# Altium project Mynd_Main.PrjPcb (part 1 of 3)
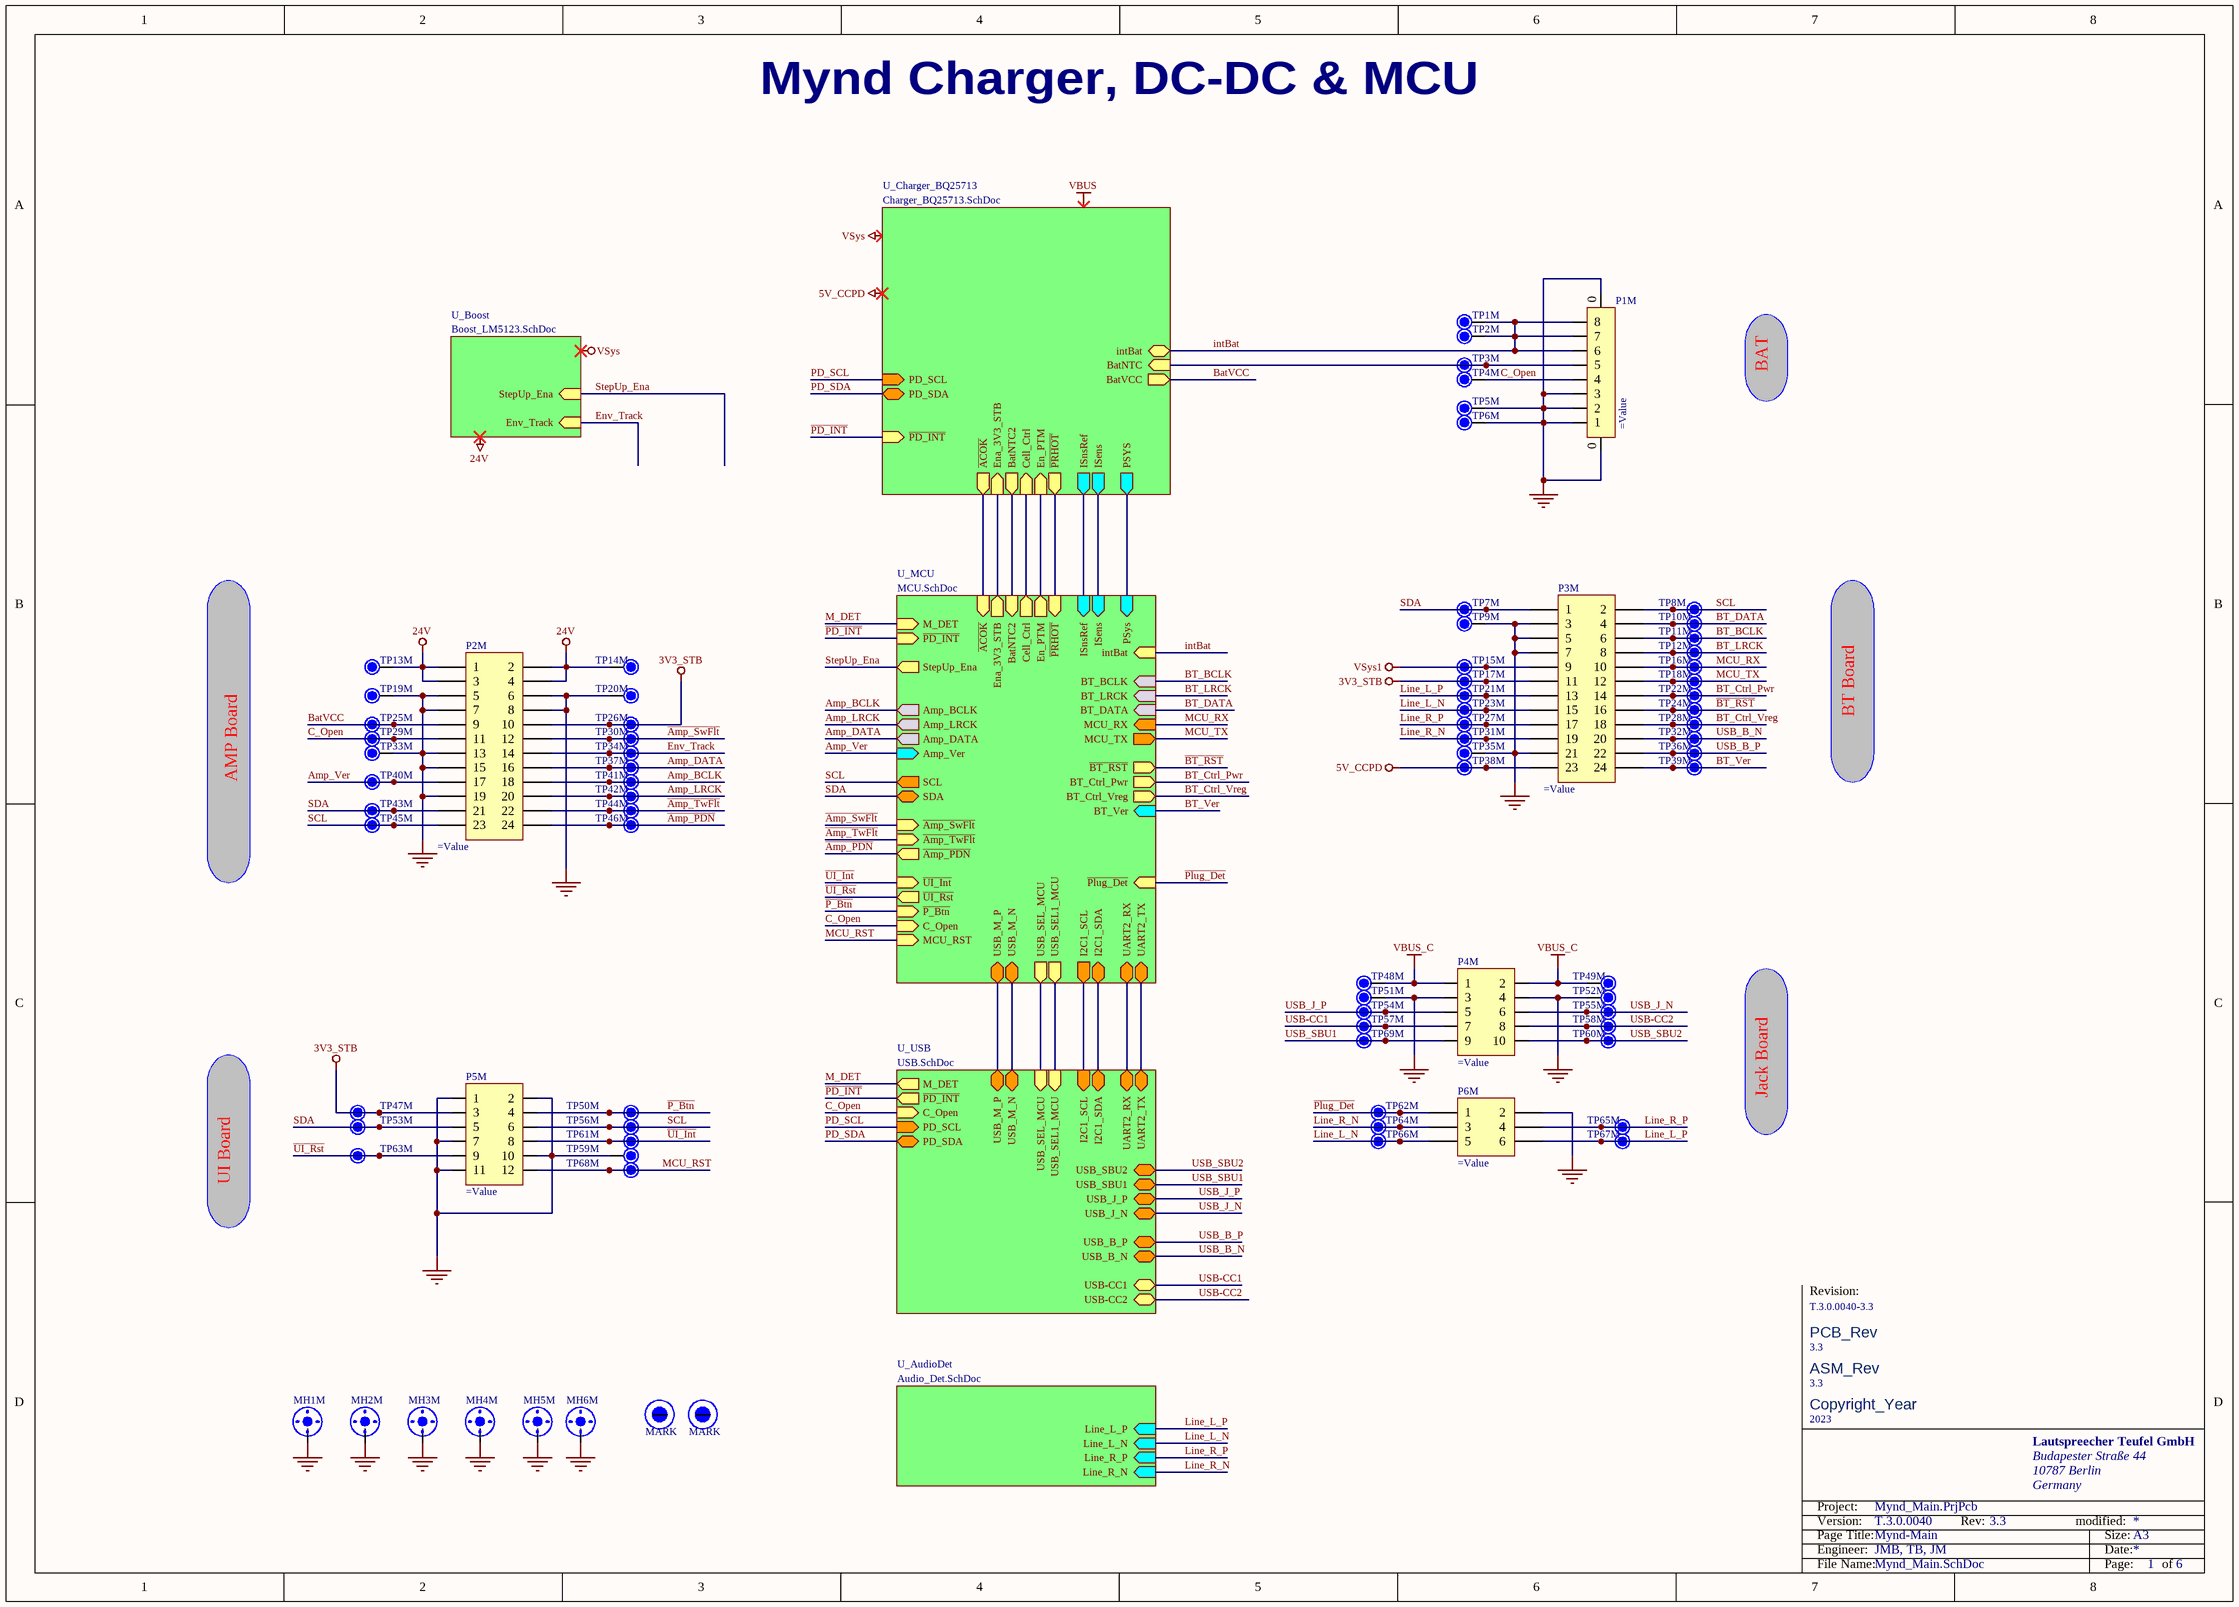
[diagram p0: Mynd_Main.SchDoc]
Address1: Budapester Straße 44; Address2: 10787 Berlin; Address3: Germany; ASM_Rev: 3.3; CompanyName: Lautsprecher Teufel GmbH; Copyright_Year: 2023; DOC_NO_SCH_DWG: Mynd_Main; Engineer: JMB, TB, JM; ISSUE_DATE: 20230810; Model_NO: PS2307; PCB_REV: 3.3; QBOM-AIEQ-NUMBER: AIEPS2307-Q0D1; QBOM-APE-NUMBER: APEPS2307-00D1; QBOM-APEQ-NUMBER: APEPS2307-Q0D1; QBOM-L-NUMBER: LRDPS2307-H001; REV_DATE: 20231025; Revision: 3.3; SCH_Approver: JianHua.Zhong; SCH_Checker: Aileen.zheng; SCH_Designer: GuoHui.Lin; SCH_REV: 3.3; SCH_Title: Mynd; Version: T.3.0.0040
6 sheets, 561 parts. Net scope: hierarchical (ports join the sheet entries above them; power ports are global).
Board file: Mynd_Main.PcbDoc
Sheets:
  Mynd_Main.SchDoc
    U_USB = USB.SchDoc
    U_MCU = MCU.SchDoc
    U_AudioDet = Audio_Det.SchDoc
    U_Boost = Boost_LM5123.SchDoc
    U_Charger_BQ25713 = Charger_BQ25713.SchDoc

## Sheet Mynd_Main.SchDoc: Mynd-Main
size A3; PageSetup: Record=PageOptions|CenterHorizontal=True|CenterVertical=True|PrintScale=0.70|XCorrection=1.00|YCorrection=1.00|PrintKind=0|BorderSize=5000000|LeftOffset=0|BottomOffset=0|Orientation=2|PaperLength=1000|PaperWidth=1000|Scale=100|PaperSource=7|PrintQuality=-4|MediaType=1|DitherType=10|PaperKind=A4|PrintScaleMode=1; ApprovedBy: Jianhua.Zhong; CheckedBy: Aileen.zheng; DrawnBy: GuoHui.Lin; Revision: 3.3; SheetNumber: 1; SheetTotal: 6; Model NO.: PS2307; ISSUE DATE: 20230810; REV DATE: 20240117; PCB_Rev: 3.3; ASM_Rev: 3.3

### Parts
MH1M  SCREW_HOLE_D30  [SCREW_D30]  (value not drawn)  (no BOM)
MH2M  SCREW_HOLE_D30  [SCREW_D30]  (value not drawn)  (no BOM)
MH3M  SCREW_HOLE_D30  [SCREW_D30]  (value not drawn)  (no BOM)
MH4M  SCREW_HOLE_D30  [SCREW_D30]  (value not drawn)  (no BOM)
MH5M  SCREW_HOLE_D30  [SCREW_D30]  (value not drawn)  (no BOM)
MH6M  SCREW_HOLE_D30  [SCREW_D30]  (value not drawn)  (no BOM)
MK1M  MARK  [MARK]  (no BOM)
MK2M  MARK  [MARK]  (no BOM)
P1M  (no value)  [CON_250_SMD_H_8P]
P2M  (no value)  [Female_SMD_Bottom_2X12_254]
P3M  (no value)  [Female_SMD_Bottom_2X12_254]
P4M  (no value)  [WB200AL_2x5P]
P5M  (no value)  [WB200AL_2x6P]
P6M  (no value)  [WB200AL_2x3P]
Teufel_ASM_Label1M  3.3  [Teufel_ASM_Rev]  (no BOM)
Teufel_Copyright1M  2023  [TEUFEL_COPYRIGHT]  (no BOM)
Teufel_PCB_Label1M  3.3  [Teufel_PCB_Rev]  (no BOM)
Teufel_PCB_Logo1M  T.3.0.0040-3.3  [Teufel_NoLogo]  (no BOM)
TP1M  TP12  [TP120]  (value not drawn)  (no BOM)
TP2M  TP12  [TP120]  (value not drawn)  (no BOM)
TP3M  TP12  [TP120]  (value not drawn)  (no BOM)
TP4M  TP12  [TP120]  (value not drawn)  (no BOM)
TP5M  TP12  [TP120]  (value not drawn)  (no BOM)
TP6M  TP12  [TP120]  (value not drawn)  (no BOM)
TP7M  TP12  [TP120]  (value not drawn)  (no BOM)
TP8M  TP12  [TP120]  (value not drawn)  (no BOM)
TP9M  TP12  [TP120]  (value not drawn)  (no BOM)
TP10M  TP12  [TP120]  (value not drawn)  (no BOM)
TP11M  TP12  [TP120]  (value not drawn)  (no BOM)
TP12M  TP12  [TP120]  (value not drawn)  (no BOM)
TP13M  TP12  [TP120]  (value not drawn)  (no BOM)
TP14M  TP12  [TP120]  (value not drawn)  (no BOM)
TP15M  TP12  [TP120]  (value not drawn)  (no BOM)
TP16M  TP12  [TP120]  (value not drawn)  (no BOM)
TP17M  TP12  [TP120]  (value not drawn)  (no BOM)
TP18M  TP12  [TP120]  (value not drawn)  (no BOM)
TP19M  TP12  [TP120]  (value not drawn)  (no BOM)
TP20M  TP12  [TP120]  (value not drawn)  (no BOM)
TP21M  TP12  [TP120]  (value not drawn)  (no BOM)
TP22M  TP12  [TP120]  (value not drawn)  (no BOM)
TP23M  TP12  [TP120]  (value not drawn)  (no BOM)
TP24M  TP12  [TP120]  (value not drawn)  (no BOM)
TP25M  TP12  [TP120]  (value not drawn)  (no BOM)
TP26M  TP12  [TP120]  (value not drawn)  (no BOM)
TP27M  TP12  [TP120]  (value not drawn)  (no BOM)
TP28M  TP12  [TP120]  (value not drawn)  (no BOM)
TP29M  TP12  [TP120]  (value not drawn)  (no BOM)
TP30M  TP12  [TP120]  (value not drawn)  (no BOM)
TP31M  TP12  [TP120]  (value not drawn)  (no BOM)
TP32M  TP12  [TP120]  (value not drawn)  (no BOM)
TP33M  TP12  [TP120]  (value not drawn)  (no BOM)
TP34M  TP12  [TP120]  (value not drawn)  (no BOM)
TP35M  TP12  [TP120]  (value not drawn)  (no BOM)
TP36M  TP12  [TP120]  (value not drawn)  (no BOM)
TP37M  TP12  [TP120]  (value not drawn)  (no BOM)
TP38M  TP12  [TP120]  (value not drawn)  (no BOM)
TP39M  TP12  [TP120]  (value not drawn)  (no BOM)
TP40M  TP12  [TP120]  (value not drawn)  (no BOM)
TP41M  TP12  [TP120]  (value not drawn)  (no BOM)
TP42M  TP12  [TP120]  (value not drawn)  (no BOM)
TP43M  TP12  [TP120]  (value not drawn)  (no BOM)
TP44M  TP12  [TP120]  (value not drawn)  (no BOM)
TP45M  TP12  [TP120]  (value not drawn)  (no BOM)
TP46M  TP12  [TP120]  (value not drawn)  (no BOM)
TP47M  TP12  [TP120]  (value not drawn)  (no BOM)
TP48M  TP12  [TP120]  (value not drawn)  (no BOM)
TP49M  TP12  [TP120]  (value not drawn)  (no BOM)
TP50M  TP12  [TP120]  (value not drawn)  (no BOM)
TP51M  TP12  [TP120]  (value not drawn)  (no BOM)
TP52M  TP12  [TP120]  (value not drawn)  (no BOM)
TP53M  TP12  [TP120]  (value not drawn)  (no BOM)
TP54M  TP12  [TP120]  (value not drawn)  (no BOM)
TP55M  TP12  [TP120]  (value not drawn)  (no BOM)
TP56M  TP12  [TP120]  (value not drawn)  (no BOM)
TP57M  TP12  [TP120]  (value not drawn)  (no BOM)
TP58M  TP12  [TP120]  (value not drawn)  (no BOM)
TP59M  TP12  [TP120]  (value not drawn)  (no BOM)
TP60M  TP12  [TP120]  (value not drawn)  (no BOM)
TP61M  TP12  [TP120]  (value not drawn)  (no BOM)
TP62M  TP12  [TP120]  (value not drawn)  (no BOM)
TP63M  TP12  [TP120]  (value not drawn)  (no BOM)
TP64M  TP12  [TP120]  (value not drawn)  (no BOM)
TP65M  TP12  [TP120]  (value not drawn)  (no BOM)
TP66M  TP12  [TP120]  (value not drawn)  (no BOM)
TP67M  TP12  [TP120]  (value not drawn)  (no BOM)
TP68M  TP12  [TP120]  (value not drawn)  (no BOM)
TP69M  TP12  [TP120]  (value not drawn)  (no BOM)

### Sub-sheets
U_AudioDet = Audio_Det.SchDoc: Line_L_P (in), Line_L_N (in), Line_R_P (in), Line_R_N (in)
U_Boost = Boost_LM5123.SchDoc: Env_Track (in), StepUp_Ena (in)
U_Charger_BQ25713 = Charger_BQ25713.SchDoc: intBat (bidir), ISens (out), ISnsRef (out), Ena_3V3_STB (in), En_PTM (in), Cell_Ctrl (in), ~{PD_INT} (in), BatNTC (in), BatNTC2 (out), PD_SCL (in), PD_SDA (bidir), ~{ACOK} (out), ~{PRHOT} (out), PSYS (out), BatVCC (out)
U_MCU = MCU.SchDoc: ~{ACOK} (in), En_PTM (out), ~{PRHOT} (in), ISnsRef (in), ISens (in), StepUp_Ena (out), ~{Amp_PDN} (out), ~{Amp_TwFlt} (in), Amp_DATA (out), Amp_LRCK (out), Amp_BCLK (out), MCU_RX (in), MCU_TX (out), ~{BT_RST} (out), BT_Ctrl_Pwr (out), BT_Ctrl_Vreg (out), ~{Plug_Det} (in), ~{UI_Int} (in), ~{UI_Rst} (out), ~{P_Btn} (in), ~{PD_INT} (in), SCL (out), SDA (bidir), Ena_3V3_STB (out), I2C1_SCL (out), I2C1_SDA (bidir), USB_M_P (bidir), USB_SEL_MCU (out), USB_M_N (bidir), C_Open (in), Cell_Ctrl (out), ~{Amp_SwFlt} (in), BT_DATA (in), BT_LRCK (in), BT_BCLK (in), BatNTC2 (in), BT_Ver (in), Amp_Ver (in), M_DET (in), PSys (in), MCU_RST (in), USB_SEL1_MCU (out), UART2_RX (bidir), UART2_TX (bidir), intBat (in)
U_USB = USB.SchDoc: I2C1_SCL (in), ~{PD_INT} (out), I2C1_SDA (bidir), USB-CC1 (bidir), USB-CC2 (bidir), USB_J_P (bidir), USB_M_N (bidir), USB_B_N (bidir), USB_J_N (bidir), USB_M_P (bidir), USB_B_P (bidir), USB_SEL_MCU (in), PD_SCL (in), PD_SDA (bidir), M_DET (out), C_Open (in), USB_SEL1_MCU (in), USB_SBU1 (bidir), USB_SBU2 (bidir), UART2_RX (bidir), UART2_TX (bidir)

### Nets
3V3_STB: P2M.10 P3M.11 P5M.3 TP17M.1 TP26M.1 TP47M.1
5V_CCPD: P3M.23 TP38M.1
24V: P2M.1 P2M.2 P2M.3 P2M.4 TP13M.1 TP14M.1
GND: MH1M.1 MH2M.1 MH3M.1 MH4M.1 MH5M.1 MH6M.1 P1M.0 P1M.1 P1M.2 P1M.3 P2M.5 P2M.6 P2M.7 P2M.8 P2M.13 P2M.15 P2M.19 P3M.3 P3M.5 P3M.7 P3M.21 P4M.3 P4M.4 P5M.1 P5M.2 P5M.7 P5M.10 P5M.11 P6M.2 TP5M.1 TP6M.1 TP9M.1 TP19M.1 TP20M.1 TP33M.1 TP35M.1 TP51M.1 TP52M.1 TP59M.1
VBUS_C: P4M.1 P4M.2 TP48M.1 TP49M.1
VSys1: P3M.9 TP15M.1
~{ACOK}: sheet U_MCU/~{ACOK}, sheet U_Charger_BQ25713/~{ACOK}
~{BT_RST}: P3M.16 TP24M.1 ; sheet U_MCU/~{BT_RST}
~{P_Btn}: P5M.4 TP50M.1 ; sheet U_MCU/~{P_Btn}
~{PD_INT}: sheet U_USB/~{PD_INT}, sheet U_MCU/~{PD_INT}, sheet U_Charger_BQ25713/~{PD_INT}
~{Plug_Det}: P6M.1 TP62M.1 ; sheet U_MCU/~{Plug_Det}
~{PRHOT}: sheet U_MCU/~{PRHOT}, sheet U_Charger_BQ25713/~{PRHOT}
~{UI_Int}: P5M.8 TP61M.1 ; sheet U_MCU/~{UI_Int}
~{UI_Rst}: P5M.9 TP63M.1 ; sheet U_MCU/~{UI_Rst}
~{Amp_PDN}: P2M.24 TP46M.1 ; sheet U_MCU/~{Amp_PDN}
~{Amp_SwFlt}: P2M.12 TP30M.1 ; sheet U_MCU/~{Amp_SwFlt}
~{Amp_TwFlt}: P2M.22 TP44M.1 ; sheet U_MCU/~{Amp_TwFlt}
Amp_BCLK: P2M.18 TP41M.1 ; sheet U_MCU/Amp_BCLK
Amp_DATA: P2M.16 TP37M.1 ; sheet U_MCU/Amp_DATA
Amp_LRCK: P2M.20 TP42M.1 ; sheet U_MCU/Amp_LRCK
Amp_Ver: P2M.17 TP40M.1 ; sheet U_MCU/Amp_Ver
BatVCC: P2M.9 TP25M.1 ; sheet U_Charger_BQ25713/BatVCC
BT_BCLK: P3M.6 TP11M.1 ; sheet U_MCU/BT_BCLK
BT_Ctrl_Pwr: P3M.14 TP22M.1 ; sheet U_MCU/BT_Ctrl_Pwr
BT_Ctrl_Vreg: P3M.18 TP28M.1 ; sheet U_MCU/BT_Ctrl_Vreg
BT_DATA: P3M.4 TP10M.1 ; sheet U_MCU/BT_DATA
BT_LRCK: P3M.8 TP12M.1 ; sheet U_MCU/BT_LRCK
BT_Ver: P3M.24 TP39M.1 ; sheet U_MCU/BT_Ver
C_Open: P1M.4 P2M.11 TP4M.1 TP29M.1 ; sheet U_USB/C_Open, sheet U_MCU/C_Open
Ena_3V3_STB: sheet U_MCU/Ena_3V3_STB, sheet U_Charger_BQ25713/Ena_3V3_STB
Env_Track: P2M.14 TP34M.1 ; sheet U_Boost/Env_Track
I2C1_SCL: sheet U_USB/I2C1_SCL, sheet U_MCU/I2C1_SCL
I2C1_SDA: sheet U_USB/I2C1_SDA, sheet U_MCU/I2C1_SDA
intBat: P1M.6 P1M.7 P1M.8 TP1M.1 TP2M.1 ; sheet U_MCU/intBat, sheet U_Charger_BQ25713/intBat
Line_L_N: P3M.15 P6M.5 TP23M.1 TP66M.1 ; sheet U_AudioDet/Line_L_N
Line_L_P: P3M.13 P6M.6 TP21M.1 TP67M.1 ; sheet U_AudioDet/Line_L_P
Line_R_N: P3M.19 P6M.3 TP31M.1 TP64M.1 ; sheet U_AudioDet/Line_R_N
Line_R_P: P3M.17 P6M.4 TP27M.1 TP65M.1 ; sheet U_AudioDet/Line_R_P
M_DET: sheet U_USB/M_DET, sheet U_MCU/M_DET
MCU_RST: P5M.12 TP68M.1 ; sheet U_MCU/MCU_RST
MCU_RX: P3M.10 TP16M.1 ; sheet U_MCU/MCU_RX
MCU_TX: P3M.12 TP18M.1 ; sheet U_MCU/MCU_TX
PD_SCL: sheet U_USB/PD_SCL, sheet U_Charger_BQ25713/PD_SCL
PD_SDA: sheet U_USB/PD_SDA, sheet U_Charger_BQ25713/PD_SDA
SCL: P2M.23 P3M.2 P5M.6 TP8M.1 TP45M.1 TP56M.1 ; sheet U_MCU/SCL
SDA: P2M.21 P3M.1 P5M.5 TP7M.1 TP43M.1 TP53M.1 ; sheet U_MCU/SDA
StepUp_Ena: sheet U_MCU/StepUp_Ena, sheet U_Boost/StepUp_Ena
UART2_RX: sheet U_USB/UART2_RX, sheet U_MCU/UART2_RX
UART2_TX: sheet U_USB/UART2_TX, sheet U_MCU/UART2_TX
USB-CC1: P4M.7 TP57M.1 ; sheet U_USB/USB-CC1
USB-CC2: P4M.8 TP58M.1 ; sheet U_USB/USB-CC2
USB_B_N: P3M.20 TP32M.1 ; sheet U_USB/USB_B_N
USB_B_P: P3M.22 TP36M.1 ; sheet U_USB/USB_B_P
USB_J_N: P4M.6 TP55M.1 ; sheet U_USB/USB_J_N
USB_J_P: P4M.5 TP54M.1 ; sheet U_USB/USB_J_P
USB_M_N: sheet U_USB/USB_M_N, sheet U_MCU/USB_M_N
USB_M_P: sheet U_USB/USB_M_P, sheet U_MCU/USB_M_P
USB_SBU1: P4M.9 TP69M.1 ; sheet U_USB/USB_SBU1
USB_SBU2: P4M.10 TP60M.1 ; sheet U_USB/USB_SBU2
NetC31E_2: sheet U_MCU/ISens, sheet U_Charger_BQ25713/ISens
NetC32E_2: sheet U_MCU/ISnsRef, sheet U_Charger_BQ25713/ISnsRef
NetC36E_1: sheet U_MCU/PSys, sheet U_Charger_BQ25713/PSYS
NetC40E_2: P1M.5 TP3M.1 ; sheet U_Charger_BQ25713/BatNTC
NetR18E_1: sheet U_MCU/Cell_Ctrl, sheet U_Charger_BQ25713/Cell_Ctrl
NetR22U_2: sheet U_USB/USB_SEL_MCU, sheet U_MCU/USB_SEL_MCU
NetR28E_1: sheet U_MCU/En_PTM, sheet U_Charger_BQ25713/En_PTM
NetR29U_2: sheet U_USB/USB_SEL1_MCU, sheet U_MCU/USB_SEL1_MCU
NetR39E_2: sheet U_MCU/BatNTC2, sheet U_Charger_BQ25713/BatNTC2

Not connected (* = marked no-connect by the designer): MK1M MK_B MK_T; MK2M MK_B MK_T

### Notes on the sheet
- Mynd Charger, DC-DC & MCU
- BAT
- BT Board
- AMP Board
- Jack Board
- UI Board
- Labels drawn without touching a wire or pin: 5V_CCPD, 24V, VBUS, VSys
- Revision:
- Lautspreecher Teufel GmbH
- Budapester Straße 44
- 10787 Berlin
- Germany
- Page Title:
- Engineer:
- Project:
- Version:
- Rev:
- modified:
- Date:
- Size:
- A3
- File Name:
- Page:
- of
- (in symbol CMP-00086-3) Copyright_Year
- (in symbol CMP-00087-3) PCB_Rev
- (in symbol CMP-00088-2) ASM_Rev

### Library data of the parts
MH1M MH2M MH3M MH4M MH5M MH6M = N-001-00011-1
MK1M MK2M = N-001-00003-2: MARK DOT; Design Item ID: MARK
P1M = C-001-1108-2: SMD WTB CONNECTOR 8P P2.5mm TIN; Part_Type: Connector SMT; Value: WT250MW-084R-0W; System: Connector; Part_Number: WT250MW-084R-0W
P2M P3M = C-001-1097-2: SMD BTB CONNECTOR 24P P2.54mm GOLD; Manufacturer: MINGHENG; Part_Type: Connector SMT; Value: 2.54FH 2x12Pin H3.55 SMT; System: Connector; Part_Number: 2.54FH 2x12Pin H3.55 SMT
P4M = C-001-1143-2: SMD WTB CONNECTOR 10P P2.0mm TIN; Manufacturer: MINGHENG; Part_Type: Connector SMT; Value: WB200AL-10; System: Connector; Part_Number: WB200AL-10
P5M = C-001-1264-2: SMD WTB CONNECTOR 12P P2.0mm TIN; Manufacturer: MINGHENG; Part_Type: Connector SMT; Value: WB200AL-12; System: Connector; Part_Number: WB200AL-12
P6M = C-001-1142-3: SMD WTB CONNECTOR 6P P2.0mm TIN; Manufacturer: MINGHENG; Part_Type: Connector SMT; Value: WB200AL-06; System: Connector; Part_Number: WB200AL-06
Teufel_ASM_Label1M = CMP-00088-2: Teufel_ASM_Rev
Teufel_Copyright1M = CMP-00086-3: Teufel_Copyright_Year
Teufel_PCB_Label1M = CMP-00087-3: Teufel_PCB_Label
Teufel_PCB_Logo1M = Teufel NoLogo: Teufel PCB NoLogo
TP1M TP2M TP3M TP4M TP5M TP6M TP7M TP8M TP9M TP10M TP11M TP12M TP13M TP14M TP15M TP16M TP17M TP18M TP19M TP20M TP21M TP22M TP23M TP24M TP25M TP26M TP27M TP28M TP29M TP30M TP31M TP32M TP33M TP34M TP35M TP36M TP37M TP38M TP39M TP40M TP41M TP42M TP43M TP44M TP45M TP46M TP47M TP48M TP49M TP50M TP51M TP52M TP53M TP54M TP55M TP56M TP57M TP58M TP59M TP60M TP61M TP62M TP63M TP64M TP65M TP66M TP67M TP68M TP69M = N-001-00010-2: Test Point; Design Item ID: TP

## Sheet USB.SchDoc: Mynd-USB-PD
size A3; PageSetup: Record=PageOptions|CenterHorizontal=True|CenterVertical=True|PrintScale=0.71|XCorrection=1.00|YCorrection=1.00|PrintKind=0|BorderSize=5000000|LeftOffset=0|BottomOffset=0|Orientation=2|PaperLength=1000|PaperWidth=1000|Scale=100|PaperSource=7|PrintQuality=-3|MediaType=1|DitherType=10|PrintScaleMode=1|PaperKind=A4|PaperIndex=9; ApprovedBy: JianHua.Zhong; CheckedBy: Aileen.zheng; DrawnBy: GuoHui.Lin; Revision: 3.3; SheetNumber: 2; SheetTotal: 6; Model NO.: PS2307; ISSUE DATE: 20230810; REV DATE: 20231025
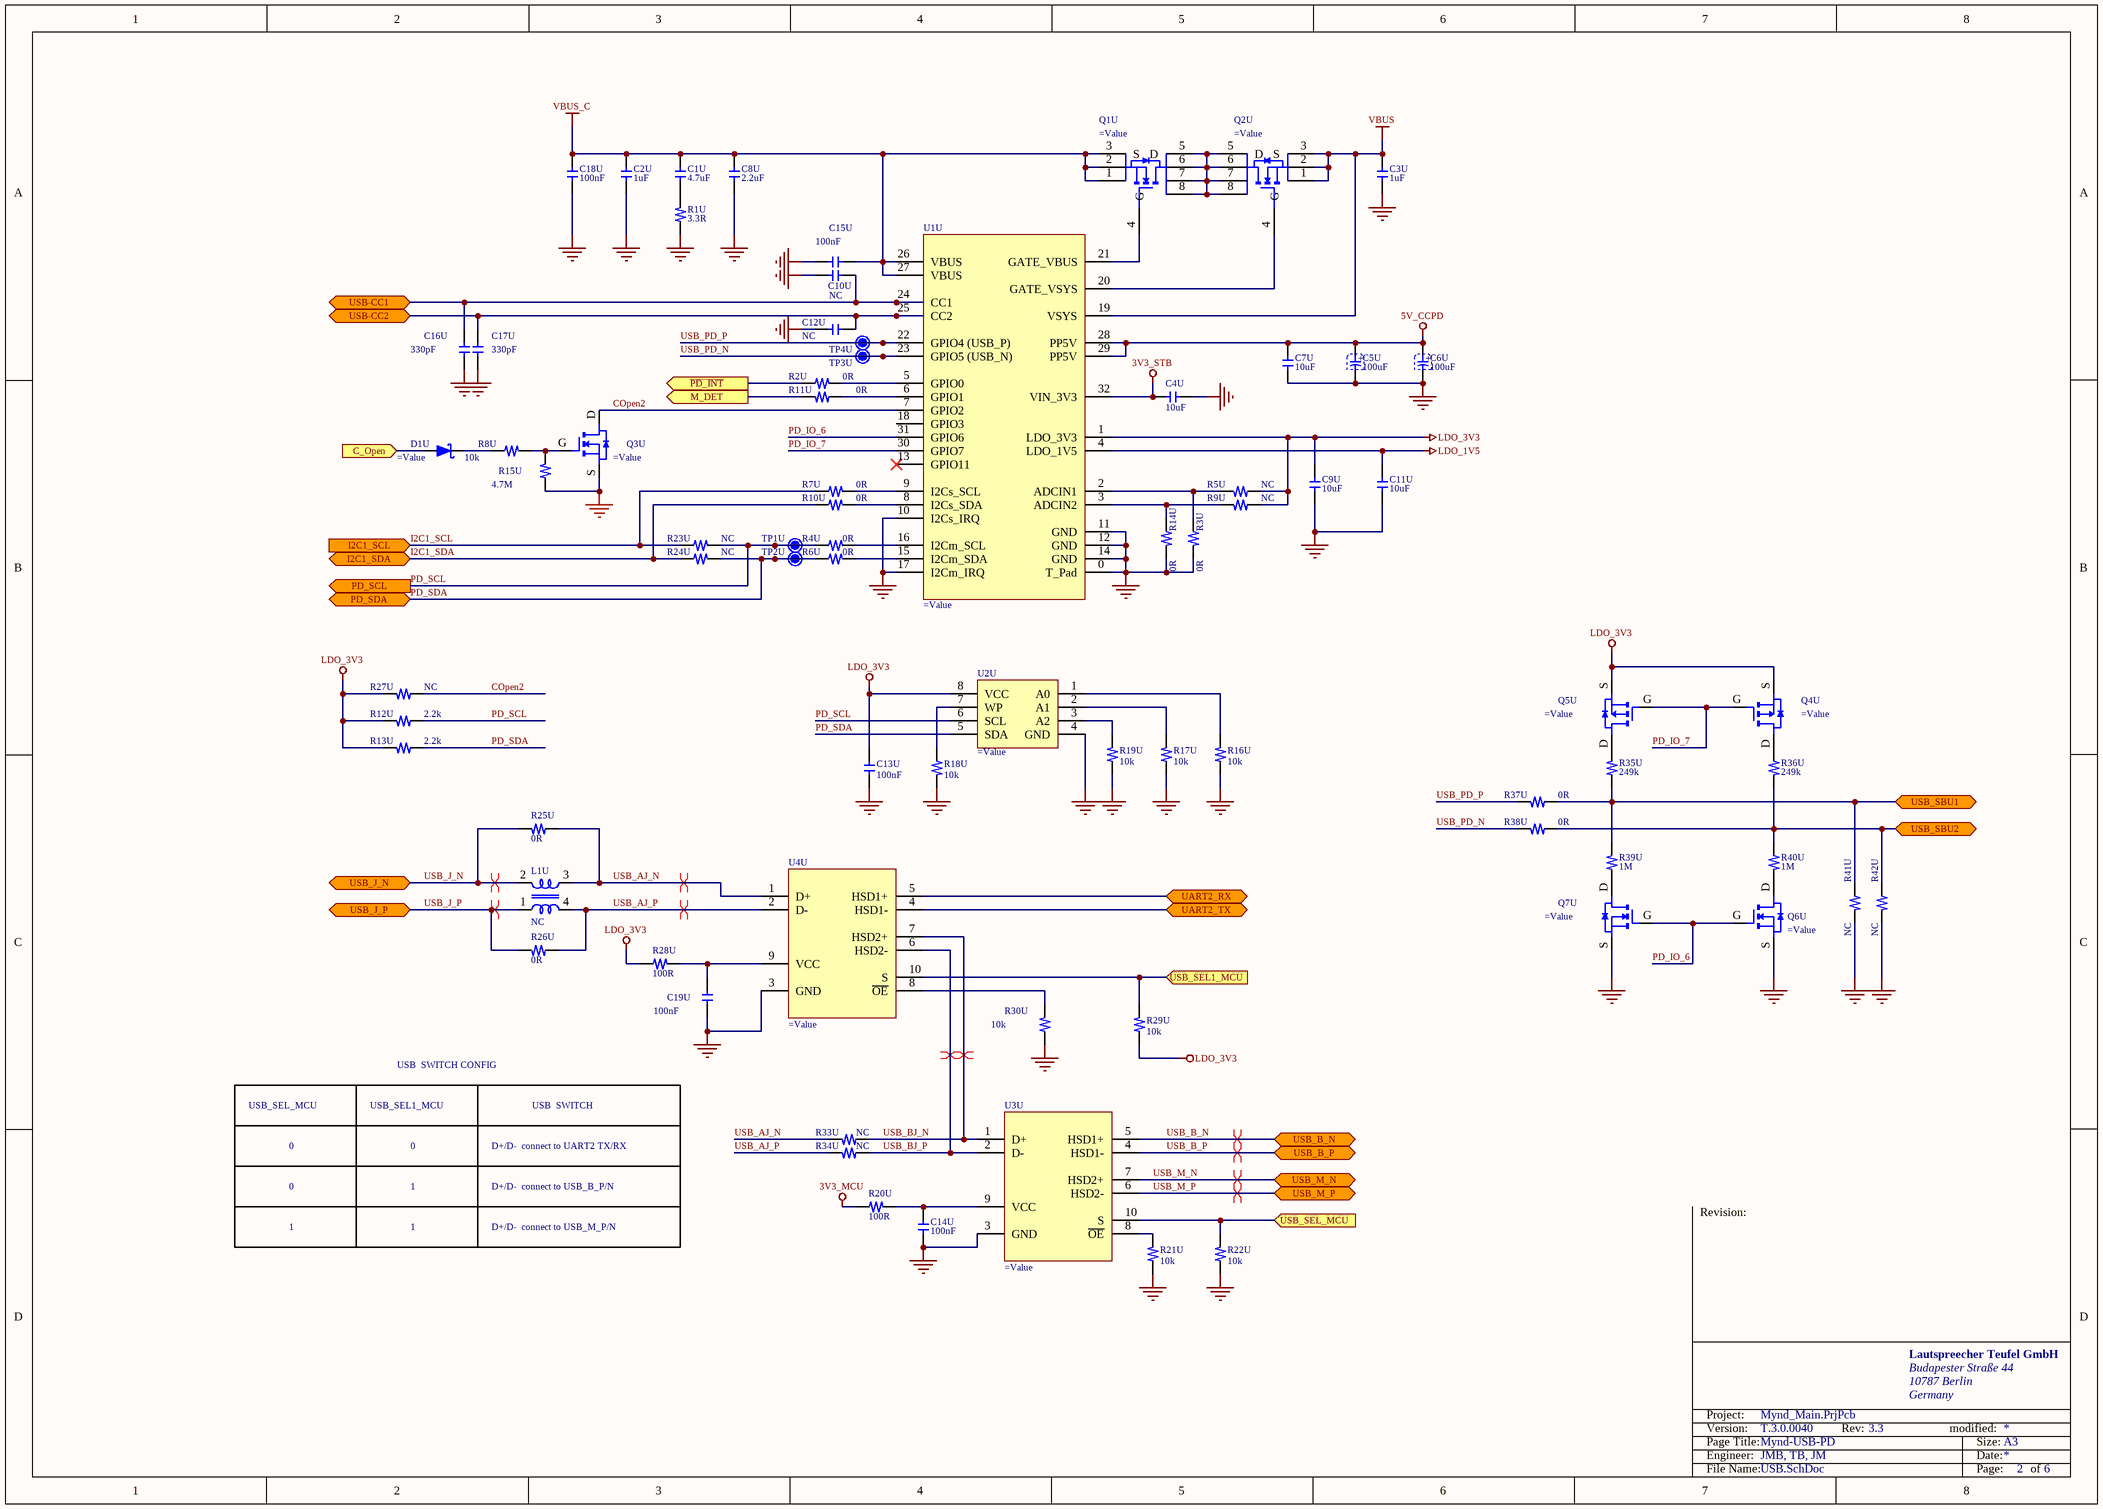
[diagram p1: USB.SchDoc]

### Parts
C1U  4.7uF  [C0805_145]
C2U  1uF  [C0805_145]
C3U  1uF  [C0805_145]
C4U  10uF  [C0805_145]
C5U  100uF  [ECAP_SMD_630X540]
C6U  100uF  [ECAP_SMD_630X540]
C7U  10uF  [C0805_145]
C8U  2.2uF  [C0805_145]
C9U  10uF  [C0805_145]
C10U  330pF  [C0603X80]  (value not drawn)
C11U  10uF  [C0805_145]
C12U  330pF  [C0603X80]  (value not drawn)
C13U  100nF  [C0603X100]
C14U  100nF  [C0603X100]
C15U  100nF  [C0603X105]
C16U  330pF  [C0603X80]
C17U  330pF  [C0603X80]
C18U  100nF  [C0603X105]
C19U  100nF  [C0603X100]
D1U  (no value)  [SOD-323]
L1U  NC  [CET2012D]
Q1U  (no value)  [DFN8_500X600X100_127_A]
Q2U  (no value)  [DFN8_500X600X100_127_A]
Q3U  (no value)  [SOT23-GSD]
Q4U  (no value)  [SOT23-GSD]
Q5U  (no value)  [SOT23-GSD]
Q6U  (no value)  [SOT23_16_GSD]
Q7U  (no value)  [SOT23_16_GSD]
R1U  3.3R  [R0603]
R2U  0R  [R0603]
R3U  0R  [R0603]
R4U  0R  [R0603]
R5U  13k  [R0603]  (value not drawn)
R6U  0R  [R0603]
R7U  0R  [R0603]
R8U  10k  [R0603]
R9U  13k  [R0603]  (value not drawn)
R10U  0R  [R0603]
R11U  0R  [R0603]
R12U  2.2k  [R0603]
R13U  2.2k  [R0603]
R14U  0R  [R0603]
R15U  4.7M  [R0603]
R16U  10k  [R0603]
R17U  10k  [R0603]
R18U  10k  [R0603]
R19U  10k  [R0603]
R20U  100R  [R0603]
R21U  10k  [R0603]
R22U  10k  [R0603]
R23U  0R  [R0603]  (value not drawn)
R24U  0R  [R0603]  (value not drawn)
R25U  0R  [R0603]
R26U  0R  [R0603]
R27U  2.2k  [R0603]  (value not drawn)
R28U  100R  [R0603]
R29U  10k  [R0603]
R30U  10k  [R0603]
R33U  0R  [R0603]  (value not drawn)
R34U  0R  [R0603]  (value not drawn)
R35U  249k  [R0402]
R36U  249k  [R0402]
R37U  0R  [R0603]
R38U  0R  [R0603]
R39U  1M  [R0402]
R40U  1M  [R0402]
R41U  0R  [R0603]  (value not drawn)
R42U  0R  [R0603]  (value not drawn)
TP1U  TP_T_60_40  [TP_T_60_40]  (value not drawn)  (no BOM)
TP2U  TP_T_60_40  [TP_T_60_40]  (value not drawn)  (no BOM)
TP3U  TP06  [TP060]  (value not drawn)  (no BOM)
TP4U  TP06  [TP060]  (value not drawn)  (no BOM)
U1U  (no value)  [QFN32_400X400X80_40_P280X280_A]
U2U  (no value)  [SO-8]
U3U  (no value)  [QFN10_180X140X60_40]
U4U  (no value)  [QFN10_180X140X60_40]

### Ports
C_Open (in), I2C1_SCL (in), I2C1_SDA (bidir), M_DET (out), PD_SCL (out), PD_SDA (bidir), UART2_RX (bidir), UART2_TX (bidir), USB-CC1 (bidir), USB-CC2 (bidir), USB_B_N (bidir), USB_B_P (bidir), USB_J_N (bidir), USB_J_P (bidir), USB_M_N (bidir), USB_M_P (bidir), USB_SBU1 (bidir), USB_SBU2 (bidir), USB_SEL1_MCU (in), USB_SEL_MCU (in), ~{PD_INT} (out)

### Nets
3V3_MCU: R20U.1
3V3_STB: C4U.2 U1U.32(VIN_3V3)
5V_CCPD: C5U.1 C6U.1 C7U.2 U1U.28(PP5V) U1U.29(PP5V)
GND: C2U.2 C3U.2 C4U.1 C5U.2 C6U.2 C7U.1 C8U.2 C9U.1 C10U.2 C11U.1 C12U.2 C13U.2 C14U.2 C15U.2 C16U.2 C17U.2 C18U.2 C19U.2 Q3U.S Q6U.S Q7U.S R1U.1 R3U.2 R14U.2 R15U.2 R16U.2 R17U.2 R18U.1 R19U.2 R21U.1 R22U.1 R30U.1 R41U.1 R42U.1 U1U.0(T_Pad) U1U.10(I2Cs_IRQ) U1U.11(GND) U1U.12(GND) U1U.14(GND) U1U.17(I2Cm_IRQ) U2U.4(GND) U3U.3(GND) U4U.3(GND)
LDO_1V5: C11U.2 U1U.4(LDO_1V5)
LDO_3V3: C9U.2 C13U.1 Q4U.S Q5U.S R5U.1 R9U.1 R12U.2 R13U.2 R27U.2 R28U.1 R29U.1 U1U.1(LDO_3V3) U2U.8(VCC)
VBUS: C3U.1 Q2U.1(S) Q2U.2(S) Q2U.3(S) U1U.19(VSYS)
VBUS_C: C1U.1 C2U.1 C8U.1 C15U.1 C18U.1 Q1U.1(S) Q1U.2(S) Q1U.3(S) U1U.26(VBUS) U1U.27(VBUS)
~{PD_INT}: R2U.1 ; port ~{PD_INT}
C_Open: D1U.A ; port C_Open
COpen2: Q3U.D R27U.1 U1U.7(GPIO2)
I2C1_SCL: R7U.1 R23U.1 ; port I2C1_SCL
I2C1_SDA: R10U.1 R24U.1 ; port I2C1_SDA
M_DET: R11U.2 ; port M_DET
PD_IO_6: Q6U.G Q7U.G U1U.31(GPIO6)
PD_IO_7: Q4U.G Q5U.G U1U.30(GPIO7)
PD_SCL: R4U.1 R12U.1 R23U.2 TP1U.1 U2U.6(SCL) ; port PD_SCL
PD_SDA: R6U.1 R13U.1 R24U.2 TP2U.1 U2U.5(SDA) ; port PD_SDA
UART2_RX: U4U.5(HSD1+) ; port UART2_RX
UART2_TX: U4U.4(HSD1-) ; port UART2_TX
USB-CC1: C10U.1 C16U.1 U1U.24(CC1) ; port USB-CC1
USB-CC2: C12U.1 C17U.1 U1U.25(CC2) ; port USB-CC2
USB_AJ_N: L1U.3 R25U.2 R33U.1 U4U.1(D+)
USB_AJ_P: L1U.4 R26U.2 R34U.1 U4U.2(D-)
USB_B_N: U3U.5(HSD1+) ; port USB_B_N
USB_B_P: U3U.4(HSD1-) ; port USB_B_P
USB_BJ_N: R33U.2 U3U.1(D+) U4U.7(HSD2+)
USB_BJ_P: R34U.2 U3U.2(D-) U4U.6(HSD2-)
USB_J_N: L1U.2 R25U.1 ; port USB_J_N
USB_J_P: L1U.1 R26U.1 ; port USB_J_P
USB_M_N: U3U.7(HSD2+) ; port USB_M_N
USB_M_P: U3U.6(HSD2-) ; port USB_M_P
USB_PD_N: R38U.2 TP3U.1 U1U.23(GPIO5_(USB_N))
USB_PD_P: R37U.1 TP4U.1 U1U.22(GPIO4_(USB_P))
USB_SBU1: R35U.2 R37U.2 R39U.1 R41U.2 ; port USB_SBU1
USB_SBU2: R36U.2 R38U.1 R40U.1 R42U.2 ; port USB_SBU2
NetC1U_2: C1U.2 R1U.2
NetC14U_1: C14U.1 R20U.2 U3U.9(VCC)
NetC19U_1: C19U.1 R28U.2 U4U.9(VCC)
NetD1U_K: D1U.K R8U.1
NetQ1U_4: Q1U.4(G) U1U.21(GATE_VBUS)
NetQ1U_5: Q1U.5(D) Q1U.6(D) Q1U.7(D) Q1U.8(D) Q2U.5(D) Q2U.6(D) Q2U.7(D) Q2U.8(D)
NetQ2U_4: Q2U.4(G) U1U.20(GATE_VSYS)
NetQ3U_G: Q3U.G R8U.2 R15U.1
NetQ4U_D: Q4U.D R36U.1
NetQ5U_D: Q5U.D R35U.1
NetQ6U_D: Q6U.D R40U.2
NetQ7U_D: Q7U.D R39U.2
NetR2U_2: R2U.2 U1U.5(GPIO0)
NetR3U_1: R3U.1 R5U.2 U1U.2(ADCIN1)
NetR4U_2: R4U.2 U1U.16(I2Cm_SCL)
NetR6U_2: R6U.2 U1U.15(I2Cm_SDA)
NetR7U_2: R7U.2 U1U.9(I2Cs_SCL)
NetR9U_2: R9U.2 R14U.1 U1U.3(ADCIN2)
NetR10U_2: R10U.2 U1U.8(I2Cs_SDA)
NetR11U_1: R11U.1 U1U.6(GPIO1)
NetR16U_1: R16U.1 U2U.1(A0)
NetR17U_1: R17U.1 U2U.2(A1)
NetR18U_2: R18U.2 U2U.7(WP)
NetR19U_1: R19U.1 U2U.3(A2)
NetR21U_2: R21U.2 U3U.8(~{OE})
NetR22U_2: R22U.2 U3U.10(S) ; port USB_SEL_MCU
NetR29U_2: R29U.2 U4U.10(S) ; port USB_SEL1_MCU
NetR30U_2: R30U.2 U4U.8(~{OE})

Not connected (* = marked no-connect by the designer): U1U 13(GPIO11)* 18(GPIO3)

### Layout directives
differential pair: USB_AJ_N, USB_AJ_P, USB_B_N, USB_B_P, USB_BJ_N, USB_BJ_P, USB_J_N, USB_J_P, USB_M_N, USB_M_P

### Notes on the sheet
- NC
- (near C12U) NC
- (near R27U) NC
- (near R41U) NC
- USB_SEL_MCU
- USB_SEL1_MCU
- USB  SWITCH CONFIG
- USB  SWITCH
- 0
- 1
- D+/D-  connect to UART2 TX/RX
- D+/D-  connect to USB_B_P/N
- (near R33U) NC
- D+/D-  connect to USB_M_P/N
- Revision:
- Lautspreecher Teufel GmbH
- Budapester Straße 44
- 10787 Berlin
- Germany
- Page Title:
- Engineer:
- Project:
- Version:
- Rev:
- modified:
- Date:
- Size:
- A3
- File Name:
- Page:
- of
- (in symbol P-001-0308-17) +

### Library data of the parts
C1U = P-001-0169-16: PSHF SMD M CAP 4.7uF 25V ±10% 0805 X7R; Manufacturer: Multi Sourced; Part_Number: Generic; Part_Type: Capacitor ceramic SMT; Tolerance: ±10%; TemperatureRange: X7R; Value: 4.7uF; Temp_Coefficient: X7R; Voltage: 25V
C2U C3U = P-001-0174-47: PSHF SMD M CAP 1uF 50V ±10% 0805 X7R; Manufacturer: Multi Sourced; Part_Number: Generic; Part_Type: Capacitor ceramic SMT; Tolerance: ±10%; TemperatureRange: X7R; Value: 1uF; Temp_Coefficient: X7R; Voltage: 50V
C4U C7U C9U C11U = P-001-0158-27: PSHF SMD M CAP 10uF 16V ±10% 0805 X7R; Manufacturer: Multi Sourced; Part_Number: Generic; Part_Type: Capacitor ceramic SMT; Tolerance: ±10%; TemperatureRange: X7R; Value: 10uF; Temp_Coefficient: X7R; Voltage: 16V
C5U C6U = P-001-0308-17: PS SMD COND ELECT 100uF 16V ±20% 105℃; Manufacturer: Multi Sourced; Part_Number: Generic; Part_Type: Capacitor electrolytic SMT; Tolerance: ±20%; TemperatureRange: 105℃; Value: 100uF; Voltage: 16V
C8U = P-001-0127-42: GPHF $ SMD M CAP 2.2uF 50V ±10% 0805 X5R; Manufacturer: Multi Sourced; Part_Number: Generic; Part_Type: Capacitor ceramic SMT; Tolerance: ±10%; TemperatureRange: X5R; Value: 2.2uF; Temp_Coefficient: X5R; Voltage: 50V
C10U C12U = P-001-0636-13: PSHF SMD M CAP 330pF 50V ±10% 0603 X7R; Manufacturer: Multi Sourced; Part_Number: Generic; Part_Type: Capacitor ceramic SMT; Tolerance: ±10%; TemperatureRange: X7R; Value: 330pF; Temp_Coefficient: X7R; Voltage: 50V
C13U C14U C19U = P-001-0035-28: PSHF SMD M CAP 100nF 25V ±10% 0603 X7R; Manufacturer: Multi Sourced; Part_Number: Generic; Part_Type: Capacitor ceramic SMT; Tolerance: ±10%; TemperatureRange: X7R; Value: 100nF; Temp_Coefficient: X7R; Voltage: 25V
C15U C18U = P-001-0008-46: GPHF SMD M CAP 100nF 50V ±5% 0603 X7R; Manufacturer: Multi Sourced; Part_Number: Generic; Part_Type: Capacitor ceramic SMT; Tolerance: ±5%; TemperatureRange: X7R; Value: 100nF; Temp_Coefficient: X7R; Voltage: 50V
C16U C17U = P-001-0387-48: GPHF SMD M CAP 330pF 50V ±5% 0603 NPO; Manufacturer: Multi Sourced; Part_Number: Generic; Part_Type: Capacitor ceramic SMT; Tolerance: ±5%; TemperatureRange: NPO; Value: 330pF; Temp_Coefficient: NPO; Voltage: 50V
D1U = R-001-0029-31: GP SMD DIODE 2P 30V SOD323 BAT54WS PANJIT; Part_Type: Semiconductor Diode SMT; Current: 0.2A; Manufacturer: PANJIT; Voltage: 30V; Value: BAT54WS; Part_Number: BAT54WS
L1U = S-001-0426-3: COMMON MODE COIL 90Ohm 100MHz 400mA; Manufacturer: CET CHAMPI; Part_Number: CET2012A-900S; Part_Type: Coil common Mode SMT; Value: 90R; Frequency: 100MHz; Current: 400mA
Q1U Q2U = R-001-0189-21: PS SMD FET 8P DFN8 AP4024GEMT-HF APEC; Manufacturer: [APEC]; Part_Type: Semiconductor Transistor SMT; Current: 60A; Voltage: 30V; Value: AP4024GEMT-HF; Part_Number: AP4024GEMT-HF
Q3U = R-001-0217-30: GP SMD FET 3P SOT23 2N7002K CTE; Part_Type: Semiconductor Transistor SMT; Current: 300MA; Voltage: 60V; Manufacturer: CTE; Value: 2N7002K; Part_Number: 2N7002K
Q4U Q5U = R-001-1323-5: GPHF SMD FET 3P -30V SOT-23 CJ3401 CJ; Part_Type: Semiconductor Transistor SMT; Current: -4.2V; Voltage: -30; Manufacturer: CJ; Value: CJ3401; Part_Number: CJ3401
Q6U Q7U = R-001-0313-12: GP FET 3P AO3402 SOT23 ALPHA 30V/4A; Manufacturer: AOS; Part_Type: Semiconductor Transistor SMT; Current: 4A; Voltage: 30V; Value: AO3402; Part_Number: AO3402
R1U = Q-001-0403-21: PS SMD RES. 3.3OHM 1/10W 1% 0603; Manufacturer: Multi-Sourced; Part_Number: Generic; Part_Type: Resistor SMT; Temp_Coefficient: 150ppm; Tolerance: 1%; Wattage: 1/10W; Value: 3.3R
R2U R4U R6U R7U R10U R11U R23U R24U = Q-001-0048-199: PS SMD RES. 0OHM 1/10W 5% 0603; Part_Type: Resistor SMT; Manufacturer: Multi-Sourced; Part_Number: Generic; Tolerance: 1%; Temp_Coefficient: 150ppm; Value: 0R; Wattage: 1/10W
R3U R14U R25U R26U R33U R34U R37U R38U R41U R42U = Q-001-0048-204: GPHF SMD RES. 0OHM 1/10W 5% 0603; Manufacturer: Multi-Sourced; Part_Number: Generic; Part_Type: Resistor SMT; Temp_Coefficient: 150ppm; Tolerance: 5%; Wattage: 1/10W; Value: 0R
R5U R9U = Q-001-0304-23: GPHF SMD RES. 13KOHM 1/10W 1% 0603; Manufacturer: Multi-Sourced; Part_Number: Generic; Part_Type: Resistor SMT; Temp_Coefficient: 150ppm; Tolerance: 1%; Wattage: 1/10W; Value: 13k
R8U = Q-001-0058-52: GPHF SMD RES. 10KOHM 1/10W 5% 0603; Manufacturer: Multi-Sourced; Part_Number: Generic; Part_Type: Resistor SMT; Temp_Coefficient: 150ppm; Tolerance: 5%; Wattage: 1/10W; Value: 10k
R12U R13U R27U = Q-001-0707-47: PS SMD RES. 2.2KOHM 1/10W 1% 0603; Part_Type: Resistor SMT; Manufacturer: Multi-Sourced; Part_Number: Generic; Temp_Coefficient: 150ppm; Tolerance: 1%; Value: 2.2k; Wattage: 1/10W
R15U = Q-001-0091-19: PS SMD RES. 4.7MOHM 1/10W 5% 0603; Manufacturer: Multi-Sourced; Part_Number: Generic; Part_Type: Resistor SMT; Temp_Coefficient: 150ppm; Tolerance: 5%; Wattage: 1/10W; Value: 4.7M
R16U R17U R18U R19U R21U R22U R29U R30U = Q-001-0036-48: PS SMD RES. 10KOHM 1/10W 1% 0603; Part_Type: Resistor SMT; Manufacturer: Multi-Sourced; Part_Number: Generic; Temp_Coefficient: 150ppm; Tolerance: 1%; Value: 10k; Wattage: 1/10W
R20U R28U = Q-001-0256-20: PS SMD RES. 100OHM 1/10W 1% 0603; Part_Type: Resistor SMT; Manufacturer: Multi-Sourced; Part_Number: Generic; Temp_Coefficient: 150ppm; Tolerance: 1%; Value: 100R; Wattage: 1/10W
R35U R36U = Q-001-1001-6: GPHF SMD RES. 249KOhm 1/16W 1% 0402; Manufacturer: Multi-Sourced; Part_Number: Generic; Part_Type: Resistor SMT; Temp_Coefficient: 150ppm; Tolerance: 1%; Wattage: 1/16W; Value: 249k
R39U R40U = Q-001-0226-61: GPHF SMD RES. 1MOHM 1/16W 1% 0402; Manufacturer: Multi-Sourced; Part_Number: Generic; Part_Type: Resistor SMT; Temp_Coefficient: 150ppm; Tolerance: 1%; Wattage: 1/16W; Value: 1M
TP1U TP2U = CMP-00089-1: Test Point; Design Item ID: TP
TP3U TP4U = N-001-00007-3: Test Point; Design Item ID: TP
U1U = R-001-1946-2: SMD IC 32P VQFN PTPS25751SRSMR TI; Part_Type: Semiconductor Integrated Circuit SMT; Manufacturer: TI; Value: PTPS25751SRSMR; Part_Number: PTPS25751SRSMR
U2U = R-001-2127-2: SMD IC 8P SOP8 FT24C512A-TSR-T; Manufacturer: HUIMANG; Part_Type: Semiconductor Integrated Circuit SMT; Value: FT24C512A-TSR-T; Part_Number: FT24C512A-TSR-T
U3U U4U = R-001-1355-8: GS SMD IC 10P UTQFN SGM7227YUWQ10G SGMICRO; Manufacturer: [SGMICRO]; Part_Type: Semiconductor Integrated Circuit SMT; Value: SGM7227YUWQ10G; Part_Number: SGM7227YUWQ10G

## Sheet MCU.SchDoc: Mynd-MCU
size A3; PageSetup: Record=PageOptions|CenterHorizontal=True|CenterVertical=True|PrintScale=0.71|XCorrection=1.00|YCorrection=1.00|PrintKind=0|BorderSize=5000000|LeftOffset=0|BottomOffset=0|Orientation=2|PaperLength=1000|PaperWidth=1000|Scale=100|PaperSource=7|PrintQuality=-3|MediaType=1|DitherType=10|PrintScaleMode=1|PaperKind=A4|PaperIndex=9; ApprovedBy: JianHua.Zhong; CheckedBy: Aileen.zheng; DrawnBy: GuoHui.Lin; Revision: 3.3; SheetNumber: 4; SheetTotal: 6; Model NO.: PS2307; ISSUE DATE: 20230810; REV DATE: 20231025
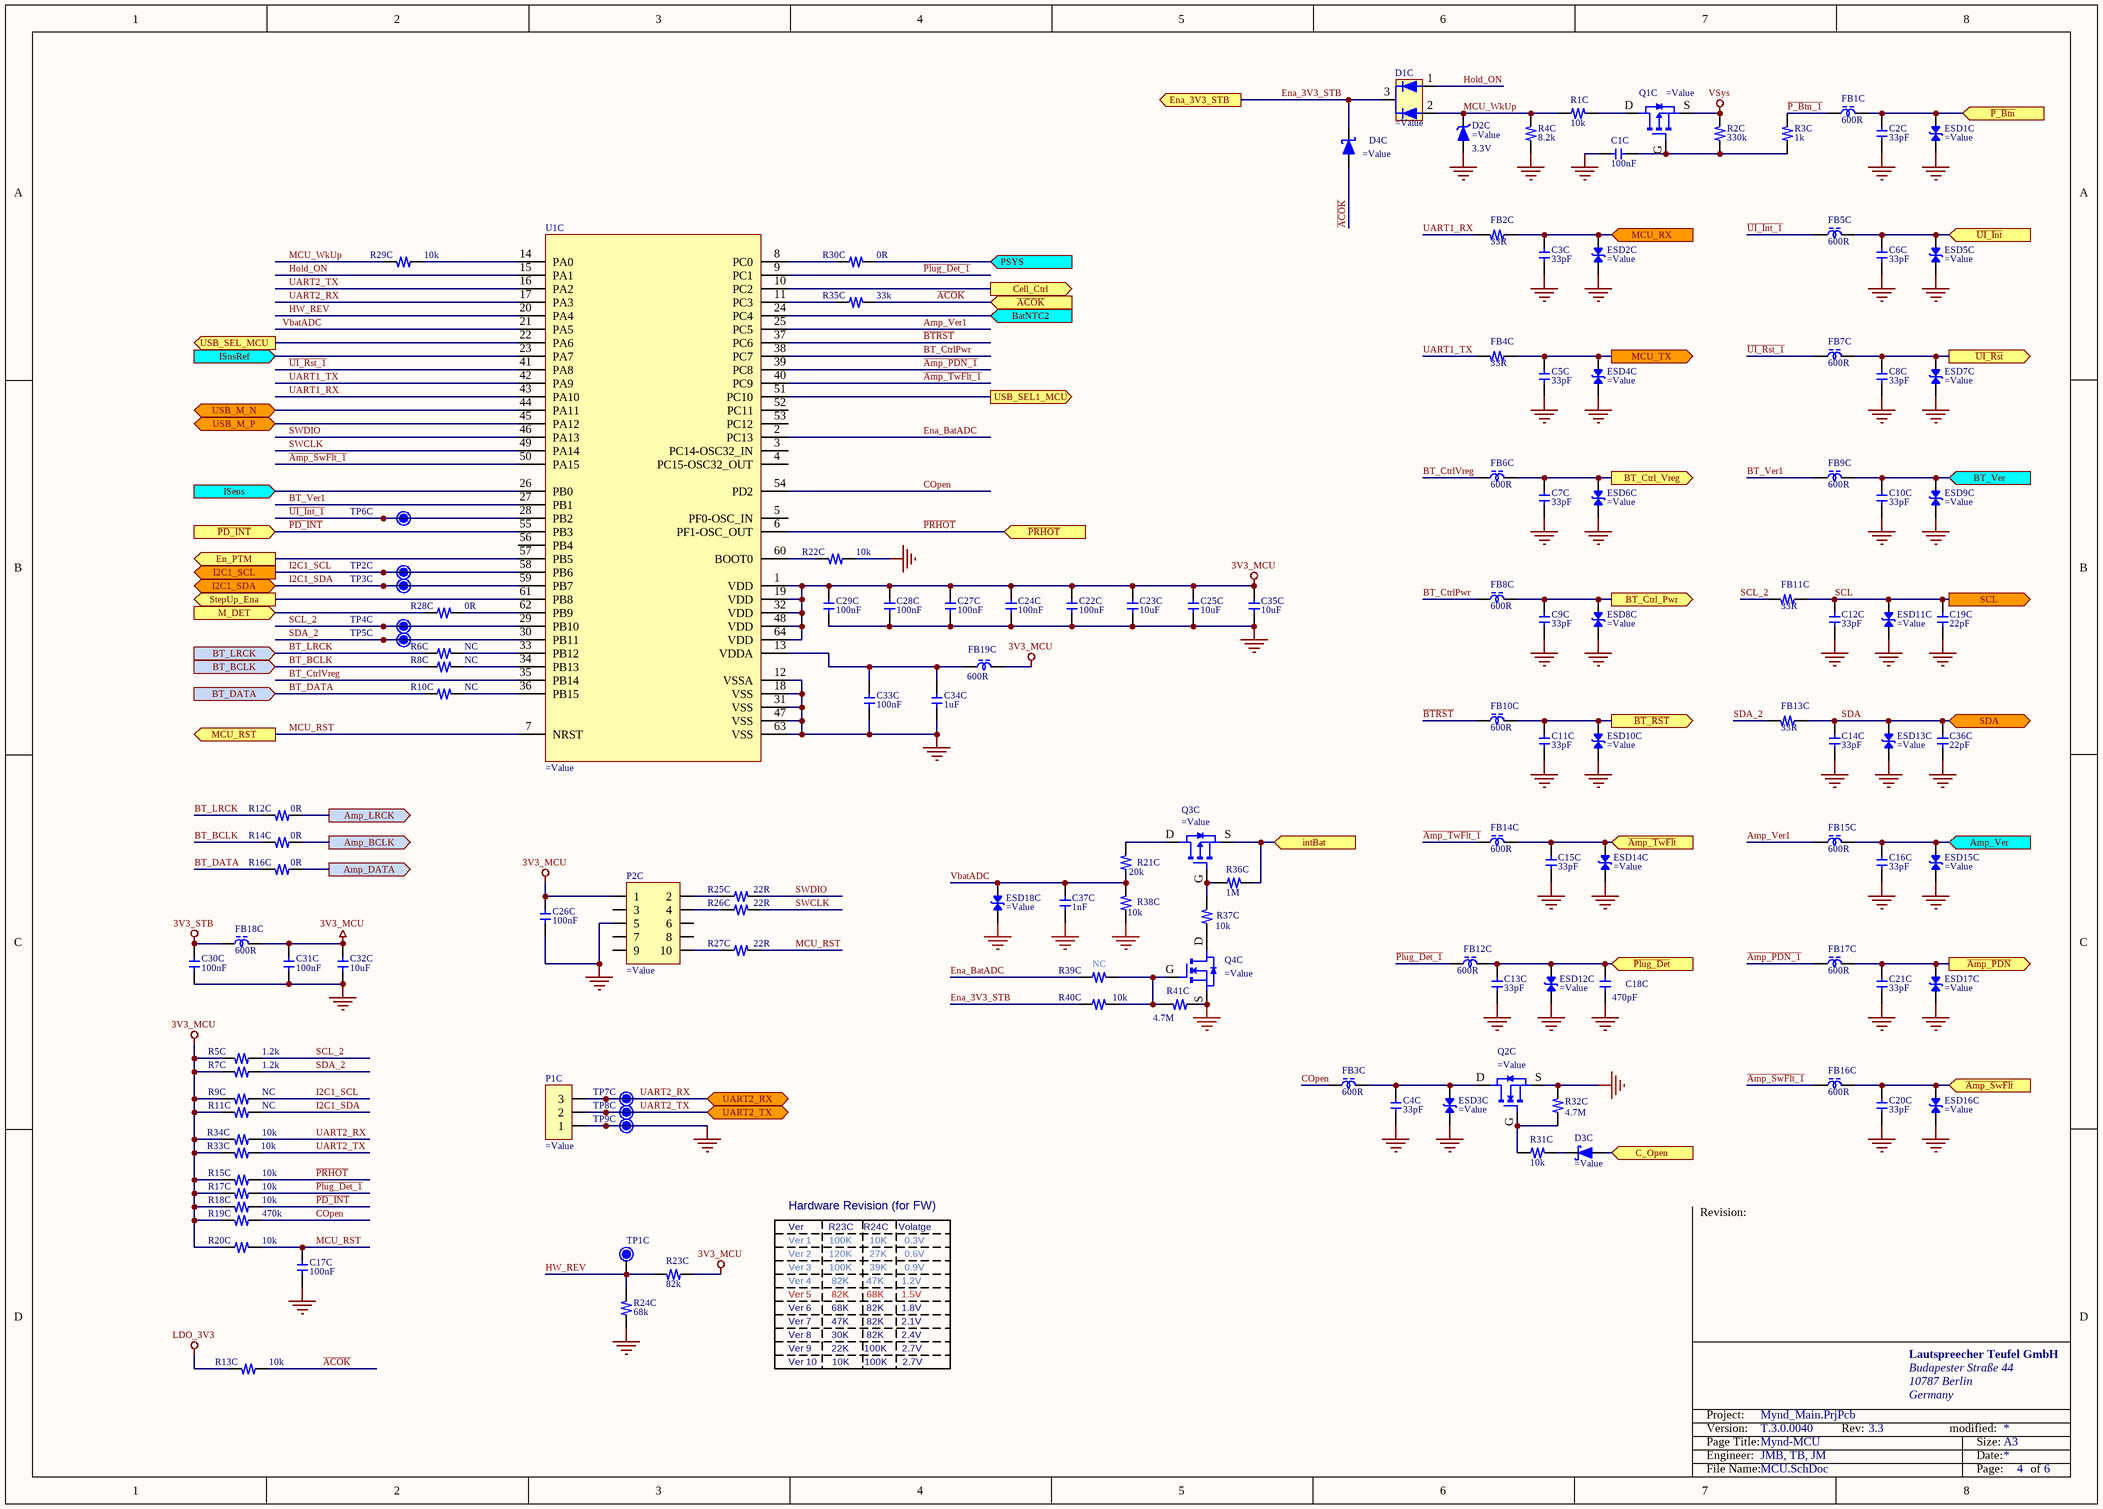
[diagram p2: MCU.SchDoc]

### Parts
C1C  100nF  [C0603X100]
C2C  33pF  [C0603X80]
C3C  33pF  [C0603X80]
C4C  33pF  [C0603X80]
C5C  33pF  [C0603X80]
C6C  33pF  [C0603X80]
C7C  33pF  [C0603X80]
C8C  33pF  [C0603X80]
C9C  33pF  [C0603X80]
C10C  33pF  [C0603X80]
C11C  33pF  [C0603X80]
C12C  33pF  [C0603X80]
C13C  33pF  [C0603X80]
C14C  33pF  [C0603X80]
C15C  33pF  [C0603X80]
C16C  33pF  [C0603X80]
C17C  100nF  [C0603X100]
C18C  470pF  [C0603X80]
C19C  22pF  [C0603X80]
C20C  33pF  [C0603X80]
C21C  33pF  [C0603X80]
C22C  100nF  [C0603X100]
C23C  10uF  [C0805_145]
C24C  100nF  [C0603X100]
C25C  10uF  [C0805_145]
C26C  100nF  [C0603X100]
C27C  100nF  [C0603X100]
C28C  100nF  [C0603X100]
C29C  100nF  [C0603X100]
C30C  100nF  [C0603X100]
C31C  100nF  [C0603X100]
C32C  10uF  [C0805_145]
C33C  100nF  [C0603X100]
C34C  1uF  [C0603X105]
C35C  10uF  [C0805_145]
C36C  22pF  [C0603X80]
C37C  1nF  [C0603X100]
D1C  (no value)  [SOT23-123]
D2C  Voltage: 3.3V  [SOD-123]
D3C  (no value)  [SOD-323]
D4C  (no value)  [SOD-323]
ESD1C  (no value)  [DFN2_100X60X50_65]
ESD2C  (no value)  [DFN2_100X60X50_65]
ESD3C  (no value)  [DFN2_100X60X50_65]
ESD4C  (no value)  [DFN2_100X60X50_65]
ESD5C  (no value)  [DFN2_100X60X50_65]
ESD6C  (no value)  [DFN2_100X60X50_65]
ESD7C  (no value)  [DFN2_100X60X50_65]
ESD8C  (no value)  [DFN2_100X60X50_65]
ESD9C  (no value)  [DFN2_100X60X50_65]
ESD10C  (no value)  [DFN2_100X60X50_65]
ESD11C  (no value)  [DFN2_100X60X50_65]
ESD12C  (no value)  [DFN2_100X60X50_65]
ESD13C  (no value)  [DFN2_100X60X50_65]
ESD14C  (no value)  [DFN2_100X60X50_65]
ESD15C  (no value)  [DFN2_100X60X50_65]
ESD16C  (no value)  [DFN2_100X60X50_65]
ESD17C  (no value)  [DFN2_100X60X50_65]
ESD18C  (no value)  [DFN2_100X60X50_65]
FB1C  600R  [L0603]
FB2C  33R  [R0603]
FB3C  600R  [L0603]
FB4C  33R  [R0603]
FB5C  600R  [L0603]
FB6C  600R  [L0603]
FB7C  600R  [L0603]
FB8C  600R  [L0603]
FB9C  600R  [L0603]
FB10C  600R  [L0603]
FB11C  33R  [R0603]
FB12C  600R  [L0603]
FB13C  33R  [R0603]
FB14C  600R  [L0603]
FB15C  600R  [L0603]
FB16C  600R  [L0603]
FB17C  600R  [L0603]
FB18C  600R  [L0603]
FB19C  600R  [L0603]
P1C  (no value)  [Pin_Header_SMD_S_T_254_3P]
P2C  (no value)  [Pin_Header_2x5_127]
Q1C  (no value)  [SOT23-GSD]
Q2C  (no value)  [SOT23-GSD]
Q3C  (no value)  [SOT23-GSD]
Q4C  (no value)  [SOT23-GSD]
R1C  10k  [R0603]
R2C  330k  [R0603]
R3C  1k  [R0603]
R4C  8.2k  [R0603]
R5C  1.2k  [R0603]
R6C  NC  [R0603]
R7C  1.2k  [R0603]
R8C  NC  [R0603]
R9C  NC  [R0603]
R10C  NC  [R0603]
R11C  NC  [R0603]
R12C  0R  [R0603]
R13C  10k  [R0603]
R14C  0R  [R0603]
R15C  10k  [R0603]
R16C  0R  [R0603]
R17C  10k  [R0603]
R18C  10k  [R0603]
R19C  470k  [R0603]
R20C  10k  [R0603]
R21C  20k  [R0603]
R22C  10k  [R0603]
R23C  82k  [R0603]
R24C  68k  [R0603]
R25C  22R  [R0603]
R26C  22R  [R0603]
R27C  22R  [R0603]
R28C  0R  [R0603]
R29C  10k  [R0603]
R30C  0R  [R0603]
R31C  10k  [R0603]
R32C  4.7M  [R0603]
R33C  10k  [R0603]
R34C  10k  [R0603]
R35C  33k  [R0603]
R36C  1M  [R0603]
R37C  10k  [R0603]
R38C  10k  [R0603]
R39C  10k  [R0603]  (value not drawn)
R40C  10k  [R0603]
R41C  4.7M  [R0603]
TP1C  TP  [TP060]  (value not drawn)  (no BOM)
TP2C  TP_T_60_40  [TP_T_60_40]  (value not drawn)  (no BOM)
TP3C  TP_T_60_40  [TP_T_60_40]  (value not drawn)  (no BOM)
TP4C  TP_T_60_40  [TP_T_60_40]  (value not drawn)  (no BOM)
TP5C  TP_T_60_40  [TP_T_60_40]  (value not drawn)  (no BOM)
TP6C  TP_T_60_40  [TP_T_60_40]  (value not drawn)  (no BOM)
TP7C  TP12  [TP120]  (value not drawn)  (no BOM)
TP8C  TP12  [TP120]  (value not drawn)  (no BOM)
TP9C  TP12  [TP120]  (value not drawn)  (no BOM)
U1C  (no value)  [LQFP64_1000X1000X160_50]

### Ports
Amp_BCLK (out), Amp_DATA (out), Amp_LRCK (out), Amp_Ver (in), BatNTC2 (in), BT_BCLK (in), BT_Ctrl_Pwr (out), BT_Ctrl_Vreg (out), BT_DATA (in), BT_LRCK (in), BT_Ver (in), C_Open (in), Cell_Ctrl (out), En_PTM (out), Ena_3V3_STB (out), I2C1_SCL (out), I2C1_SDA (bidir), intBat (in), ISens (in), ISnsRef (in), M_DET (in), MCU_RST (out), MCU_RX (in), MCU_TX (out), PSYS (in), SCL (out), SDA (bidir), StepUp_Ena (out), UART2_RX (bidir), UART2_TX (bidir), USB_M_N (bidir), USB_M_P (bidir), USB_SEL1_MCU (out), USB_SEL_MCU (out), ~{ACOK} (in), ~{Amp_PDN} (out), ~{Amp_SwFlt} (in), ~{Amp_TwFlt} (in), ~{BT_RST} (out), ~{P_Btn} (in), ~{PD_INT} (in), ~{Plug_Det} (in), ~{PRHOT} (in), ~{UI_Int} (in), ~{UI_Rst} (out)

### Nets
3V3_MCU: C22C.1 C23C.1 C24C.1 C25C.1 C26C.1 C27C.1 C28C.1 C29C.1 C31C.1 C32C.1 C35C.2 FB18C.2 FB19C.2 P2C.1 R5C.1 R7C.1 R9C.1 R11C.1 R15C.1 R17C.1 R18C.1 R19C.1 R20C.2 R23C.1 R33C.1 R34C.1 U1C.1(VDD) U1C.19(VDD) U1C.32(VDD) U1C.48(VDD) U1C.64(VDD)
3V3_STB: C30C.1 FB18C.1
GND: C1C.2 C2C.2 C3C.2 C4C.2 C5C.2 C6C.2 C7C.2 C8C.2 C9C.2 C10C.2 C11C.2 C12C.2 C13C.2 C14C.2 C15C.2 C16C.2 C17C.2 C18C.2 C19C.2 C20C.2 C21C.2 C22C.2 C23C.2 C24C.2 C25C.2 C26C.2 C27C.2 C28C.2 C29C.2 C30C.2 C31C.2 C32C.2 C33C.2 C34C.2 C35C.1 C36C.2 C37C.2 D2C.A ESD1C.2 ESD2C.1 ESD3C.1 ESD4C.1 ESD5C.1 ESD6C.1 ESD7C.1 ESD8C.1 ESD9C.1 ESD10C.1 ESD11C.1 ESD12C.1 ESD13C.1 ESD14C.1 ESD15C.1 ESD16C.1 ESD17C.1 ESD18C.1 P1C.1 P2C.5 Q2C.S Q4C.S R4C.1 R22C.1 R24C.1 R32C.2 R38C.1 R41C.2 TP9C.1 U1C.12(VSSA) U1C.18(VSS) U1C.31(VSS) U1C.47(VSS) U1C.63(VSS)
LDO_3V3: R13C.1
VSys: Q1C.S R2C.2
~{ACOK}: D4C.A R13C.2 R35C.1 ; port ~{ACOK}
~{Amp_PDN_1}: FB17C.1 U1C.39(PC8)
~{Amp_SwFlt_1}: FB16C.1 U1C.50(PA15)
~{Amp_TwFlt_1}: FB14C.1 U1C.40(PC9)
~{BT_RST}: C11C.1 ESD10C.2 FB10C.2 ; port ~{BT_RST}
~{BTRST}: FB10C.1 U1C.37(PC6)
~{P_Btn}: C2C.1 ESD1C.1 FB1C.2 ; port ~{P_Btn}
~{P_Btn_1}: FB1C.1 R3C.2
~{PD_INT}: R18C.2 U1C.55(PB3) ; port ~{PD_INT}
~{Plug_Det}: C13C.1 C18C.1 ESD12C.2 FB12C.2 ; port ~{Plug_Det}
~{Plug_Det_1}: FB12C.1 R17C.2 U1C.9(PC1)
~{PRHOT}: R15C.2 U1C.6(PF1-OSC_OUT) ; port ~{PRHOT}
~{UI_Int}: C6C.1 ESD5C.2 FB5C.2 ; port ~{UI_Int}
~{UI_Int_1}: FB5C.1 TP6C.1 U1C.28(PB2)
~{UI_Rst}: C8C.1 ESD7C.2 FB7C.2 ; port ~{UI_Rst}
~{UI_Rst_1}: FB7C.1 U1C.41(PA8)
~{Amp_PDN}: C21C.1 ESD17C.2 FB17C.2 ; port ~{Amp_PDN}
~{Amp_SwFlt}: C20C.1 ESD16C.2 FB16C.2 ; port ~{Amp_SwFlt}
~{Amp_TwFlt}: C15C.1 ESD14C.2 FB14C.2 ; port ~{Amp_TwFlt}
Amp_BCLK: R14C.2 ; port Amp_BCLK
Amp_DATA: R16C.2 ; port Amp_DATA
Amp_LRCK: R12C.2 ; port Amp_LRCK
Amp_Ver: C16C.1 ESD15C.2 FB15C.2 ; port Amp_Ver
Amp_Ver1: FB15C.1 U1C.25(PC5)
BT_BCLK: R8C.2 R14C.1 ; port BT_BCLK
BT_Ctrl_Pwr: C9C.1 ESD8C.2 FB8C.2 ; port BT_Ctrl_Pwr
BT_Ctrl_Vreg: C7C.1 ESD6C.2 FB6C.2 ; port BT_Ctrl_Vreg
BT_CtrlPwr: FB8C.1 U1C.38(PC7)
BT_CtrlVreg: FB6C.1 U1C.35(PB14)
BT_DATA: R10C.2 R16C.1 ; port BT_DATA
BT_LRCK: R6C.2 R12C.1 ; port BT_LRCK
BT_Ver: C10C.1 ESD9C.2 FB9C.2 ; port BT_Ver
BT_Ver1: FB9C.1 U1C.27(PB1)
C_Open: D3C.A ; port C_Open
COpen: FB3C.1 R19C.2 U1C.54(PD2)
Ena_3V3_STB: D1C.3 D4C.K R40C.1 ; port Ena_3V3_STB
Ena_BatADC: R39C.1 U1C.2(PC13)
Hold_ON: D1C.1 U1C.15(PA1)
HW_REV: R23C.2 R24C.2 TP1C.1 U1C.20(PA4)
I2C1_SCL: R9C.2 TP2C.1 U1C.58(PB6) ; port I2C1_SCL
I2C1_SDA: R11C.2 TP3C.1 U1C.59(PB7) ; port I2C1_SDA
intBat: Q3C.S R36C.2 ; port intBat
M_DET: R28C.2 ; port M_DET
MCU_RST: C17C.1 R20C.1 R27C.1 U1C.7(NRST) ; port MCU_RST
MCU_RX: C3C.1 ESD2C.2 FB2C.2 ; port MCU_RX
MCU_TX: C5C.1 ESD4C.2 FB4C.2 ; port MCU_TX
MCU_WkUp: D1C.2 D2C.K R1C.1 R4C.2 R29C.2
SCL: C12C.1 C19C.1 ESD11C.2 FB11C.2 ; port SCL
SCL_2: FB11C.1 R5C.2 TP4C.1 U1C.29(PB10)
SDA: C14C.1 C36C.1 ESD13C.2 FB13C.2 ; port SDA
SDA_2: FB13C.1 R7C.2 TP5C.1 U1C.30(PB11)
StepUp_Ena: U1C.61(PB8) ; port StepUp_Ena
SWCLK: R26C.1 U1C.49(PA14)
SWDIO: R25C.1 U1C.46(PA13)
UART1_RX: FB2C.1 U1C.43(PA10)
UART1_TX: FB4C.1 U1C.42(PA9)
UART2_RX: P1C.3 R34C.2 TP7C.1 U1C.17(PA3) ; port UART2_RX
UART2_TX: P1C.2 R33C.2 TP8C.1 U1C.16(PA2) ; port UART2_TX
USB_M_N: U1C.44(PA11) ; port USB_M_N
USB_M_P: U1C.45(PA12) ; port USB_M_P
VbatADC: C37C.1 ESD18C.2 R21C.1 R38C.2 U1C.21(PA5)
NetC1C_1: C1C.1 Q1C.G R2C.1 R3C.1
NetC4C_1: C4C.1 ESD3C.2 FB3C.2 Q2C.D
NetC31E_2: U1C.26(PB0) ; port ISens
NetC32E_2: U1C.23(PA7) ; port ISnsRef
NetC33C_1: C33C.1 C34C.1 FB19C.1 U1C.13(VDDA)
NetC36E_1: R30C.1 ; port PSYS
NetD3C_K: D3C.K R31C.1
NetP2C_2: P2C.2 R25C.2
NetP2C_4: P2C.4 R26C.2
NetP2C_10: P2C.10 R27C.2
NetQ1C_D: Q1C.D R1C.2
NetQ2C_G: Q2C.G R31C.2 R32C.1
NetQ3C_D: Q3C.D R21C.2
NetQ3C_G: Q3C.G R36C.1 R37C.2
NetQ4C_D: Q4C.D R37C.1
NetQ4C_G: Q4C.G R39C.2 R40C.2 R41C.1
NetR6C_1: R6C.1 U1C.33(PB12)
NetR8C_1: R8C.1 U1C.34(PB13)
NetR10C_1: R10C.1 U1C.36(PB15)
NetR18E_1: U1C.10(PC2) ; port Cell_Ctrl
NetR22C_2: R22C.2 U1C.60(BOOT0)
NetR22U_2: U1C.22(PA6) ; port USB_SEL_MCU
NetR28C_1: R28C.1 U1C.62(PB9)
NetR28E_1: U1C.57(PB5) ; port En_PTM
NetR29C_1: R29C.1 U1C.14(PA0)
NetR29U_2: U1C.51(PC10) ; port USB_SEL1_MCU
NetR30C_2: R30C.2 U1C.8(PC0)
NetR35C_2: R35C.2 U1C.11(PC3)
NetR39E_2: U1C.24(PC4) ; port BatNTC2

Not connected (* = marked no-connect by the designer): P2C 3 6 7 8 9; U1C 3(PC14-OSC32_IN) 4(PC15-OSC32_OUT) 5(PF0-OSC_IN) 52(PC11) 53(PC12) 56(PB4)

### Notes on the sheet
- (near R39C) NC
- Ver 1       100K       10K       0.3V
- Ver          R23C    R24C    Volatge
- Hardware Revision (for FW)
- Ver 2       120K       27K       0.6V
- Ver 3       100K       39K       0.9V
- Ver 4        82K       47K       1.2V
- Ver 5        82K       68K       1.5V
- Ver 6        68K       82K       1.8V
- Ver 7        47K       82K       2.1V
- Ver 8        30K       82K       2.4V
- Ver 9        22K      100K      2.7V
- Ver 10      10K      100K      2.7V
- Revision:
- Lautspreecher Teufel GmbH
- Budapester Straße 44
- 10787 Berlin
- Germany
- Page Title:
- Engineer:
- Project:
- Version:
- Rev:
- modified:
- Date:
- Size:
- A3
- File Name:
- Page:
- of

### Library data of the parts
C1C C17C C22C C24C C26C C27C C28C C29C C30C C31C C33C = P-001-0074-61: PSHF SMD M CAP 100nF 50V ±10% 0603 X7R; Manufacturer: Multi Sourced; Part_Number: Generic; Part_Type: Capacitor ceramic SMT; Tolerance: ±10%; TemperatureRange: X7R; Value: 100nF; Temp_Coefficient: X7R; Voltage: 50V
C2C C3C C4C C5C C6C C7C C8C C9C C10C C11C C12C C13C C14C C15C C16C C20C C21C = P-001-0394-18: PSHF SMD M CAP 33pF 50V ±5% 0603 NPO; Manufacturer: Multi Sourced; Part_Number: Generic; Part_Type: Capacitor ceramic SMT; Tolerance: ±5%; TemperatureRange: NPO; Value: 33pF; Temp_Coefficient: NPO; Voltage: 50V
C18C = P-001-0647-10: GPHF SMD CAP 470pF 50V 10%; Manufacturer: Multi Sourced; Part_Number: Generic; Part_Type: Capacitor ceramic SMT; TemperatureRange: X7R; Tolerance: ±10%; Value: 470pF; Temp_Coefficient: X7R; Voltage: 50V
C19C C36C = P-001-0244-44: GPHF SMD M CAP 22pF 50V ±5% 0603 NPO; Manufacturer: Multi Sourced; Part_Number: Generic; Part_Type: Capacitor ceramic SMT; Tolerance: ±5%; TemperatureRange: NPO; Value: 22pF; Temp_Coefficient: NPO; Voltage: 50V
C23C C25C C32C C35C = P-001-0158-27: as C4U on sheet USB; Tolerance: ±10%; TemperatureRange: X7R; Value: 10uF; Temp_Coefficient: X7R; Voltage: 16V
C34C = P-001-0040-42: PSHF SMD M CAP 1uF 16V ±10% 0603 X7R; Manufacturer: Multi Sourced; Part_Number: Generic; Part_Type: Capacitor ceramic SMT; Tolerance: ±10%; TemperatureRange: X7R; Value: 1uF; Temp_Coefficient: X7R; Voltage: 16V
C37C = P-001-0073-51: GPHF SMD M CAP 1nF 50V ±10% 0603 X7R; Manufacturer: Multi Sourced; Part_Number: Generic; Part_Type: Capacitor ceramic SMT; Tolerance: ±10%; TemperatureRange: X7R; Value: 1nF; Temp_Coefficient: X7R; Voltage: 50V
D1C = R-001-0027-12: PS SMD DIODE 3P 30V SOT-23 BAT54C CJ; Manufacturer: [CJ]; Part_Type: Semiconductor Diode SMT; Current: 0.2A; Voltage: 30V; Value: BAT54C; Part_Number: BAT54C
D2C = R-001-0336-16: GP SMD ZENER 3.3V 0.5W SOD-123 CJ; Manufacturer: [CJ]; Part_Type: Semiconductor Diode Zener; Value: BZT52C3V3; Part_Number: BZT52C3V3
D3C D4C = R-001-0029-31: as D1U on sheet USB; Manufacturer: PANJIT; Voltage: 30V; Value: BAT54WS; Part_Number: BAT54WS
ESD1C = R-001-1347-2: SMD TVS 2P DFN1006 BDFN2C121V; Manufacturer: []; Part_Type: Semiconductor Diode TVS; Value: BDFN2C121V; Part_Number: BDFN2C121V
ESD2C ESD3C ESD4C ESD5C ESD6C ESD7C ESD8C ESD9C ESD10C ESD11C ESD12C ESD13C ESD14C ESD15C ESD16C ESD17C ESD18C = R-001-0237-38: GP SMD TVS 2P DFN1006-2 AU3321P1 APM; Part_Type: Semiconductor Diode TVS; Voltage: 3.3V; Manufacturer: APM; Value: AU3321P1; Part_Number: AU3321P1
FB1C FB3C FB5C FB6C FB7C FB8C FB9C FB10C FB14C FB15C FB16C FB17C FB18C FB19C = S-001-0008-33: PSHF SMD FERRITE BEAD 600OHM 25% 0603; Manufacturer: TSA; Part_Number: HCB1608KF-601T20; Part_Type: Ferrite Bead SMT; Current: 2A; Tolerance: 1:25%; Frequency: 100MHZ; Value: 600R
FB2C FB4C FB11C FB13C = Q-001-0059-31: GPHF SMD RES. 33OHM 1/10W 5% 0603; Manufacturer: Multi-Sourced; Part_Number: Generic; Part_Type: Resistor SMT; Temp_Coefficient: 150ppm; Tolerance: 5%; Wattage: 1/10W; Value: 33R
FB12C = S-001-0008-33: PSHF SMD FERRITE BEAD 600OHM 25% 0603; Manufacturer: TSA; Part_Number: HCB1608KF-601T20; Part_Type: Ferrite Bead SMT; Tolerance: 1:25%; Frequency: 100MHZ; Current: 2A; Value: 600R
P1C = C-001-0512-9: GP HEADER PIN 3P P=2.54mm 90° GOLD; Manufacturer: [null]; Part_Type: Connector SMT; Value: 3P PITCH=2.54mm; Part_Number: 3P PITCH=2.54mm
P2C = C-001-1091-2: SMD BTB CONNECTOR 10P P1.27mm GOLD; Manufacturer: MINGHENG; Part_Type: Connector SMT; Value: 1.27PH 2X5P H2.0 SMT; Part_Number: 1.27PH 2X5P H2.0 SMT
Q1C Q3C = R-001-1323-4: GS SMD FET 3P -30V SOT-23 CJ3401 CJ; Manufacturer: [CJ]; Part_Type: Semiconductor Transistor SMT; Current: -4.2V; Voltage: -30; Value: CJ3401; Part_Number: CJ3401
Q2C Q4C = R-001-0217-30: as Q3U on sheet USB; Manufacturer: CTE; Value: 2N7002K; Part_Number: 2N7002K
R1C R9C R11C R13C R15C R17C R18C R20C R22C R29C R33C R34C = Q-001-0036-48: as R16U on sheet USB; Tolerance: 1%; Wattage: 1/10W
  R1C R13C R15C R17C R18C R20C R22C R29C R33C R34C: Value: 10k
  R9C R11C: Value: NC
R2C = Q-001-0378-19: PS SMD RES. 330KOHM 1/10W 1% 0603; Part_Type: Resistor SMT; Manufacturer: Multi-Sourced; Part_Number: Generic; Temp_Coefficient: 150ppm; Tolerance: 1%; Value: 330k; Wattage: 1/10W
R3C = Q-001-0033-26: PS SMD RES. 1KOHM 1/10W 1% 0603; Part_Type: Resistor SMT; Manufacturer: Multi-Sourced; Part_Number: Generic; Temp_Coefficient: 150ppm; Tolerance: 1%; Value: 1k; Wattage: 1/10W
R4C = Q-001-0049-26: PS SMD RES. 8.2KOHM 1/10W 1% 0603; Part_Type: Resistor SMT; Manufacturer: Multi-Sourced; Part_Number: Generic; Temp_Coefficient: 150ppm; Tolerance: 1%; Value: 8.2k; Wattage: 1/10W
R5C R7C = Q-001-0265-28: PS SMD RES. 1.2KOHM 1/10W 1% 0603; Part_Type: Resistor SMT; Manufacturer: Multi-Sourced; Part_Number: Generic; Temp_Coefficient: 150ppm; Tolerance: 1%; Value: 1.2k; Wattage: 1/10W
R6C R8C R10C R28C = Q-001-0048-199: PS SMD RES. 0OHM 1/10W 5% 0603; Manufacturer: Multi-Sourced; Part_Number: Generic; Part_Type: Resistor SMT; Temp_Coefficient: 150ppm; Tolerance: 5%; Wattage: 1/10W
  R6C R8C R10C: Value: NC
  R28C: Value: 0R
R12C R14C R16C R30C = Q-001-0048-199: as R2U on sheet USB; Value: 0R; Wattage: 1/10W
R19C = Q-001-0432-19: PS SMD RES. 470KOHM 1/10W 1% 0603; Part_Type: Resistor SMT; Manufacturer: Multi-Sourced; Part_Number: Generic; Temp_Coefficient: 150ppm; Tolerance: 1%; Value: 470k; Wattage: 1/10W
R21C = Q-001-0323-29: GPHF SMD RES. 20KOHM 1/10W 1% 0603; Manufacturer: Multi-Sourced; Part_Number: Generic; Part_Type: Resistor SMT; Temp_Coefficient: 150ppm; Tolerance: 1%; Wattage: 1/10W; Value: 20k
R23C = Q-001-0026-26: GPHF SMD RES. 82KOHM 1/10W 1% 0603; Manufacturer: Multi-Sourced; Part_Number: Generic; Part_Type: Resistor SMT; Temp_Coefficient: 150ppm; Tolerance: 1%; Wattage: 1/10W; Value: 82k
R24C = Q-001-0485-26: GPHF SMD RES. 68KOHM 1/10W 1% 0603; Manufacturer: Multi-Sourced; Part_Number: Generic; Part_Type: Resistor SMT; Temp_Coefficient: 150ppm; Tolerance: 1%; Wattage: 1/10W; Value: 68k
R25C R26C R27C = Q-001-0242-29: PS SMD RES. 22OHM 1/10W 5% 0603; Part_Type: Resistor SMT; Manufacturer: Multi-Sourced; Part_Number: Generic; Tolerance: 1%; Temp_Coefficient: 150ppm; Value: 22R; Wattage: 1/10W
R31C R37C R38C R39C R40C = Q-001-0036-49: PS SMD RES. 10KOHM 1/10W 1% 0603; Manufacturer: Multi-Sourced; Part_Number: Generic; Part_Type: Resistor SMT; Temp_Coefficient: 150ppm; Tolerance: 1%; Wattage: 1/10W; Value: 10k
R32C R41C = Q-001-0091-19: as R15U on sheet USB; Tolerance: 5%; Wattage: 1/10W; Value: 4.7M
R35C = Q-001-0388-45: GPHF SMD RES. 33KOHM 1/10W 1% 0603; Manufacturer: Multi-Sourced; Part_Number: Generic; Part_Type: Resistor SMT; Temp_Coefficient: 150ppm; Tolerance: 1%; Wattage: 1/10W; Value: 33k
R36C = Q-001-0044-22: GPHF SMD RES. 1MOHM 1/10W 1% 0603; Manufacturer: Multi-Sourced; Part_Number: Generic; Part_Type: Resistor SMT; Temp_Coefficient: 150ppm; Tolerance: 1%; Wattage: 1/10W; Value: 1M
TP1C = N-001-00007-3: Test Point; Design Item ID: TP
TP2C TP3C TP4C TP5C TP6C = CMP-00089-1: Test Point; Design Item ID: TP
TP7C TP8C TP9C = N-001-00010-2: Test Point; Design Item ID: TP
U1C = R-001-1651-2: SMD IC 64P LQFP STM32F072RBT6 ST; Part_Type: Semiconductor Integrated Circuit SMT; Manufacturer: ST; Part_Number: STM32F072RBT6; Value: STM32F072RBT6